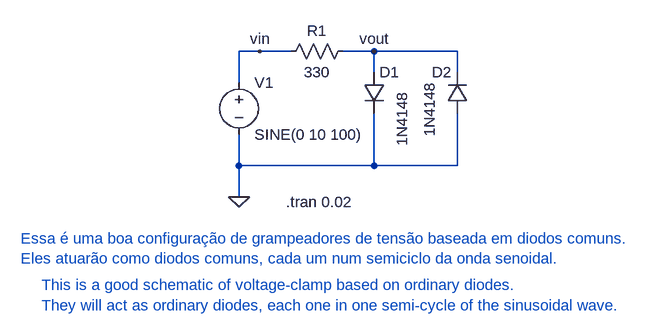
[diagram p0: schematic diodes_good_voltage_clamp.asc]
diodes_good_voltage_clamp.asc, the LTspice schematic file:
Version 4
SHEET 1 1168 680
WIRE 112 48 80 48
WIRE 160 48 112 48
WIRE 288 48 240 48
WIRE 416 48 288 48
WIRE 288 80 288 48
WIRE 416 80 416 48
WIRE 80 96 80 48
WIRE 80 224 80 176
WIRE 288 224 288 144
WIRE 288 224 80 224
WIRE 416 224 416 144
WIRE 416 224 288 224
WIRE 80 272 80 224
FLAG 80 272 0
FLAG 112 48 vin
FLAG 288 48 vout
SYMBOL voltage 80 80 R0
WINDOW 123 0 0 Left 0
WINDOW 39 0 0 Left 0
SYMATTR InstName V1
SYMATTR Value SINE(0 10 100)
SYMBOL res 256 32 R90
WINDOW 0 0 56 VBottom 2
WINDOW 3 32 56 VTop 2
SYMATTR InstName R1
SYMATTR Value 330
SYMBOL diode 272 80 R0
WINDOW 3 59 29 VRight 2
SYMATTR InstName D1
SYMATTR Value 1N4148
SYMBOL diode 432 144 R180
WINDOW 0 24 64 Left 2
WINDOW 3 59 -35 VRight 2
SYMATTR InstName D2
SYMATTR Value 1N4148
TEXT 152 280 Left 2 !.tran 0.02
TEXT -256 336 Left 2 ;Essa é uma boa configuração de grampeadores de tensão baseada em diodos comuns. \nEles atuarão como diodos comuns, cada um num semiciclo da onda senoidal.
TEXT -224 408 Left 2 ;This is a good schematic of voltage-clamp based on ordinary diodes.\nThey will act as ordinary diodes, each one in one semi-cycle of the sinusoidal wave.

The netlist it stands for:
* diodes_good_voltage_clamp.asc
V1 vin 0 SINE(0 10 100)
R1 vout vin 330
D1 vout 0 1N4148
D2 0 vout 1N4148
.model D D
.lib standard.dio
.tran 0.02
* Essa é uma boa configuração de grampeadores de tensão baseada em diodos comuns.
* Eles atuarão como diodos comuns, cada um num semiciclo da onda senoidal.
* This is a good schematic of voltage-clamp based on ordinary diodes.
* They will act as ordinary diodes, each one in one semi-cycle of the sinusoidal wave.
.backanno
.end